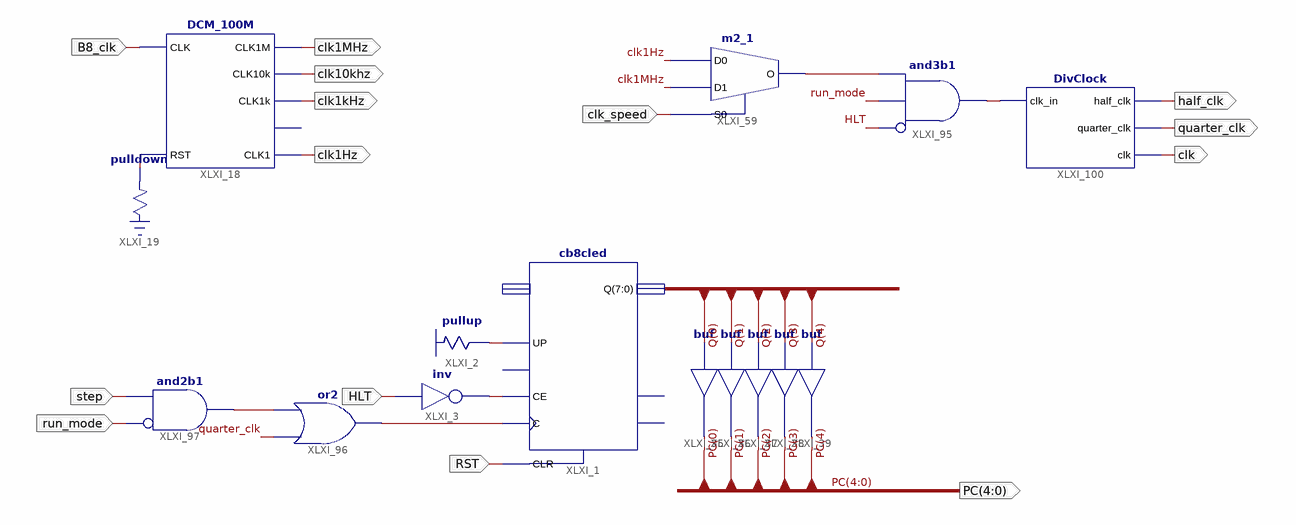
[diagram p0: schematic sheet 1]
// Xilinx ISE schematic Prog_Counter.sch (spartan3e) as structural Verilog: 15 symbols, 14 ports
module Prog_Counter (
  input  HLT,
  input  run_mode,
  input  B8_clk,
  input  RST,
  input  step,
  input  clk_speed,
  output clk1Hz,
  output clk1MHz,
  output quarter_clk,
  output clk1kHz,
  output clk10khz,
  output [4:0] PC,
  output half_clk,
  output clk
);

  wire XLXN_2, XLXN_4, XLXN_62, XLXN_135, XLXN_139, XLXN_141, XLXN_146;
  wire [7:0] Q;

  DCM_100M XLXI_18 (
    .CLK(B8_clk), .RST(XLXN_62), .CLK1M(clk1MHz), .CLK10k(clk10khz), .CLK1k(clk1kHz), .CLK1(clk1Hz));  // open: CLK100
  \pulldown  XLXI_19 (.O(XLXN_62));
  \pullup  XLXI_2 (.O(XLXN_2));
  not XLXI_3 (XLXN_4, HLT);
  cb8cled XLXI_1 (.C(XLXN_139), .CE(XLXN_4), .CLR(RST), .UP(XLXN_2), .Q(Q));  // open: D, L, CEO, TC
  buf XLXI_35 (PC[0], Q[0]);
  buf XLXI_36 (PC[1], Q[1]);
  buf XLXI_37 (PC[2], Q[2]);
  buf XLXI_38 (PC[3], Q[3]);
  buf XLXI_39 (PC[4], Q[4]);
  or XLXI_96 (XLXN_139, quarter_clk, XLXN_141);
  and XLXI_97 (XLXN_141, ~run_mode, step);  // and2b1
  m2_1 XLXI_59 (.D0(clk1Hz), .D1(clk1MHz), .S0(clk_speed), .O(XLXN_135));
  and XLXI_95 (XLXN_146, ~HLT, run_mode, XLXN_135);  // and3b1
  DivClock XLXI_100 (.clk_in(XLXN_146), .half_clk(half_clk), .quarter_clk(quarter_clk), .clk(clk));
endmodule
